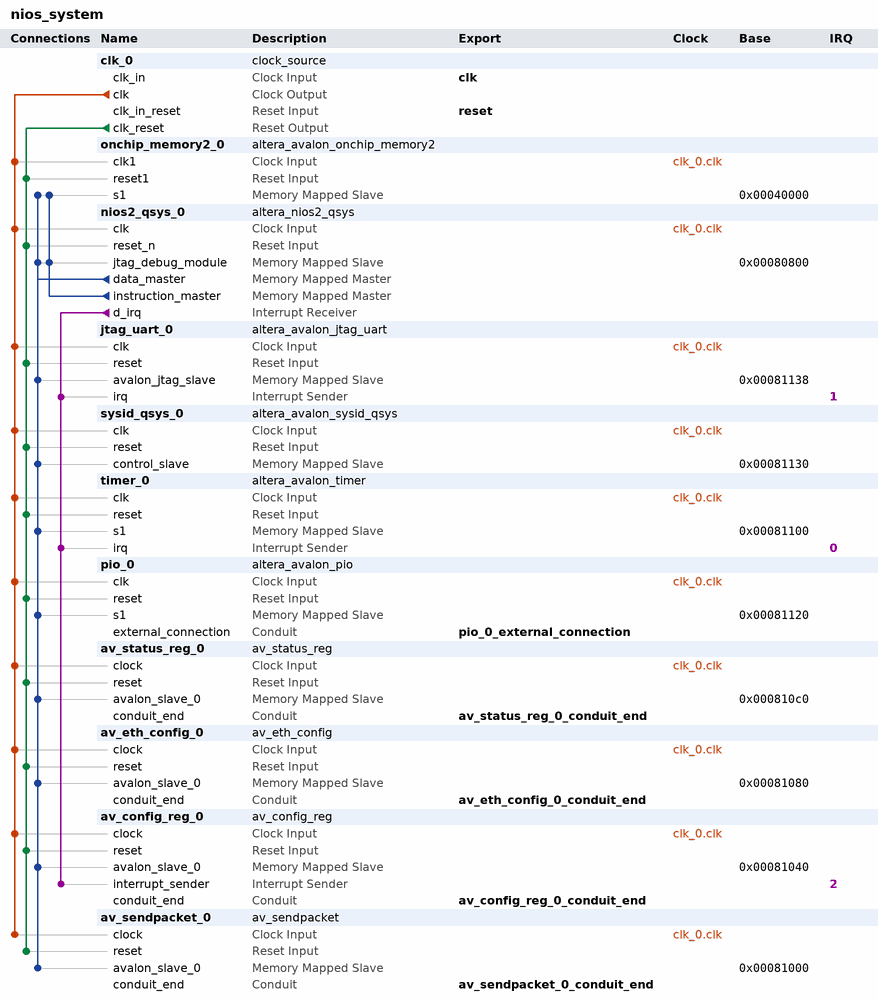
[diagram p0: system contents]
# Platform Designer (Qsys) system nios_system, Cyclone III EP3C120F780C7
# Parameters at their usual value, and those the tool derives, are not listed.
package require -exact qsys 13.0.1
create_system nios_system
set_project_property DEVICE_FAMILY {Cyclone III}
set_project_property DEVICE EP3C120F780C7

add_instance clk_0 clock_source 13.0
set_instance_parameter_value clk_0 clockFrequency 50000000

add_instance onchip_memory2_0 altera_avalon_onchip_memory2 13.0.1
set_instance_parameter_value onchip_memory2_0 dataWidth 32
set_instance_parameter_value onchip_memory2_0 dualPort false
set_instance_parameter_value onchip_memory2_0 initMemContent true
set_instance_parameter_value onchip_memory2_0 initializationFileName nios.hex
set_instance_parameter_value onchip_memory2_0 memorySize 200000

add_instance nios2_qsys_0 altera_nios2_qsys 13.0
set_instance_parameter_value nios2_qsys_0 resetSlave onchip_memory2_0.s1
set_instance_parameter_value nios2_qsys_0 mmu_TLBMissExcSlave None
set_instance_parameter_value nios2_qsys_0 exceptionSlave onchip_memory2_0.s1
set_instance_parameter_value nios2_qsys_0 breakSlave nios2_qsys_0.jtag_debug_module
set_instance_parameter_value nios2_qsys_0 impl Tiny
set_instance_parameter_value nios2_qsys_0 icache_size 4096

add_instance jtag_uart_0 altera_avalon_jtag_uart 13.0.1
set_instance_parameter_value jtag_uart_0 simInteractiveOptions NO_INTERACTIVE_WINDOWS

add_instance sysid_qsys_0 altera_avalon_sysid_qsys 13.0
set_instance_parameter_value sysid_qsys_0 id 0

add_instance timer_0 altera_avalon_timer 13.0.1
set_instance_parameter_value timer_0 period 1
set_instance_parameter_value timer_0 periodUnits MSEC

add_instance pio_0 altera_avalon_pio 13.0.1
set_instance_parameter_value pio_0 direction Output
set_instance_parameter_value pio_0 width 1

add_instance av_status_reg_0 av_status_reg 1.0

add_instance av_eth_config_0 av_eth_config 1.0

add_instance av_config_reg_0 av_config_reg 1.0

add_instance av_sendpacket_0 av_sendpacket 2.0

# connections
add_connection clk_0.clk av_config_reg_0.clock clock
add_connection clk_0.clk av_eth_config_0.clock clock
add_connection clk_0.clk av_sendpacket_0.clock clock
add_connection clk_0.clk av_status_reg_0.clock clock
add_connection clk_0.clk jtag_uart_0.clk clock
add_connection clk_0.clk nios2_qsys_0.clk clock
add_connection clk_0.clk onchip_memory2_0.clk1 clock
add_connection clk_0.clk pio_0.clk clock
add_connection clk_0.clk sysid_qsys_0.clk clock
add_connection clk_0.clk timer_0.clk clock
add_connection clk_0.clk_reset av_config_reg_0.reset reset
add_connection clk_0.clk_reset av_eth_config_0.reset reset
add_connection clk_0.clk_reset av_sendpacket_0.reset reset
add_connection clk_0.clk_reset av_status_reg_0.reset reset
add_connection clk_0.clk_reset jtag_uart_0.reset reset
add_connection clk_0.clk_reset nios2_qsys_0.reset_n reset
add_connection clk_0.clk_reset onchip_memory2_0.reset1 reset
add_connection clk_0.clk_reset pio_0.reset reset
add_connection clk_0.clk_reset sysid_qsys_0.reset reset
add_connection clk_0.clk_reset timer_0.reset reset
add_connection nios2_qsys_0.data_master av_config_reg_0.avalon_slave_0 avalon
set_connection_parameter_value nios2_qsys_0.data_master/av_config_reg_0.avalon_slave_0 baseAddress 0x00081040
add_connection nios2_qsys_0.data_master av_eth_config_0.avalon_slave_0 avalon
set_connection_parameter_value nios2_qsys_0.data_master/av_eth_config_0.avalon_slave_0 baseAddress 0x00081080
add_connection nios2_qsys_0.data_master av_sendpacket_0.avalon_slave_0 avalon
set_connection_parameter_value nios2_qsys_0.data_master/av_sendpacket_0.avalon_slave_0 baseAddress 0x00081000
add_connection nios2_qsys_0.data_master av_status_reg_0.avalon_slave_0 avalon
set_connection_parameter_value nios2_qsys_0.data_master/av_status_reg_0.avalon_slave_0 baseAddress 0x000810c0
add_connection nios2_qsys_0.data_master jtag_uart_0.avalon_jtag_slave avalon
set_connection_parameter_value nios2_qsys_0.data_master/jtag_uart_0.avalon_jtag_slave baseAddress 0x00081138
add_connection nios2_qsys_0.data_master nios2_qsys_0.jtag_debug_module avalon
set_connection_parameter_value nios2_qsys_0.data_master/nios2_qsys_0.jtag_debug_module baseAddress 0x00080800
add_connection nios2_qsys_0.data_master onchip_memory2_0.s1 avalon
set_connection_parameter_value nios2_qsys_0.data_master/onchip_memory2_0.s1 baseAddress 0x00040000
add_connection nios2_qsys_0.data_master pio_0.s1 avalon
set_connection_parameter_value nios2_qsys_0.data_master/pio_0.s1 baseAddress 0x00081120
add_connection nios2_qsys_0.data_master sysid_qsys_0.control_slave avalon
set_connection_parameter_value nios2_qsys_0.data_master/sysid_qsys_0.control_slave baseAddress 0x00081130
add_connection nios2_qsys_0.data_master timer_0.s1 avalon
set_connection_parameter_value nios2_qsys_0.data_master/timer_0.s1 baseAddress 0x00081100
add_connection nios2_qsys_0.instruction_master nios2_qsys_0.jtag_debug_module avalon
set_connection_parameter_value nios2_qsys_0.instruction_master/nios2_qsys_0.jtag_debug_module baseAddress 0x00080800
add_connection nios2_qsys_0.instruction_master onchip_memory2_0.s1 avalon
set_connection_parameter_value nios2_qsys_0.instruction_master/onchip_memory2_0.s1 baseAddress 0x00040000
add_connection nios2_qsys_0.d_irq av_config_reg_0.interrupt_sender interrupt
set_connection_parameter_value nios2_qsys_0.d_irq/av_config_reg_0.interrupt_sender irqNumber 2
add_connection nios2_qsys_0.d_irq jtag_uart_0.irq interrupt
set_connection_parameter_value nios2_qsys_0.d_irq/jtag_uart_0.irq irqNumber 1
add_connection nios2_qsys_0.d_irq timer_0.irq interrupt
set_connection_parameter_value nios2_qsys_0.d_irq/timer_0.irq irqNumber 0

# exported interfaces
add_interface clk clock sink
set_interface_property clk EXPORT_OF clk_0.clk_in
add_interface reset reset sink
set_interface_property reset EXPORT_OF clk_0.clk_in_reset
add_interface pio_0_external_connection conduit end
set_interface_property pio_0_external_connection EXPORT_OF pio_0.external_connection
add_interface av_status_reg_0_conduit_end conduit end
set_interface_property av_status_reg_0_conduit_end EXPORT_OF av_status_reg_0.conduit_end
add_interface av_eth_config_0_conduit_end conduit end
set_interface_property av_eth_config_0_conduit_end EXPORT_OF av_eth_config_0.conduit_end
add_interface av_config_reg_0_conduit_end conduit end
set_interface_property av_config_reg_0_conduit_end EXPORT_OF av_config_reg_0.conduit_end
add_interface av_sendpacket_0_conduit_end conduit end
set_interface_property av_sendpacket_0_conduit_end EXPORT_OF av_sendpacket_0.conduit_end

set_interconnect_requirement {$system} qsys_mm.clockCrossingAdapter HANDSHAKE
set_interconnect_requirement {$system} qsys_mm.maxAdditionalLatency 1

save_system nios_system.qsys
